# EAGLE design WallPower_5V2A (EAGLE 7.6.0)
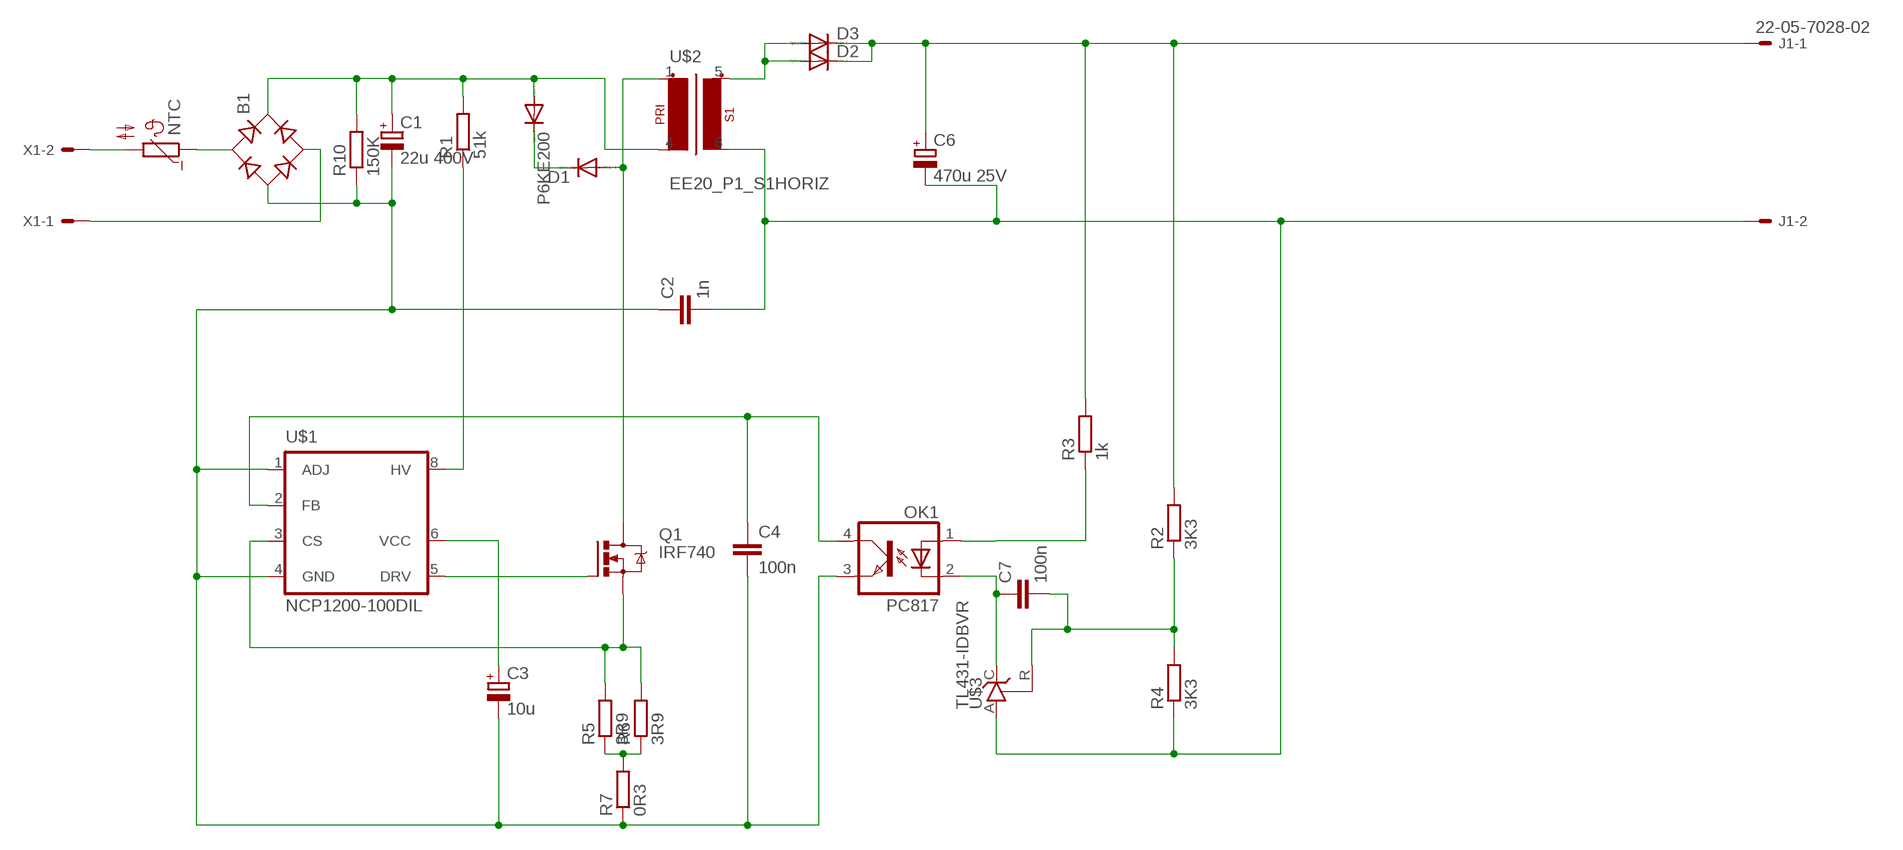
[diagram p0: schematic, sheet 1]

## Parts
B1  RB1A  [RB1A]
C1  22u 400V  CPOL-EUE5-13  [E5-13]
C2  1n  C-EU050-024X044  [C050-024X044]
C3  10u  CPOL-EUE2.5-5  [E2,5-5]
C4  100n  C-EUC0805  [C0805]
C6  470u 25V  CPOL-EUE2.5-7  [E2,5-7]
C7  100n  C-EUC0805  [C0805]
D1  DIODE-DO-214AC  [DO-214AC]
D2  DIODE-DO-214AC  [DO-214AC]
D3  DIODE-DO-214AC  [DO-214AC]
J1  22-05-7028-02  [7395-02]
NTC  B57164  [B57164]
OK1  PC817  [DIL04]
P6KE200  DIODE-DO15-12  [DO15-12]
Q1  IRF740  [TO220BV]
R1  51k  R-EU_0922/22  [0922/22]
R2  3K3  R-EU_R1206  [R1206]
R3  1k  R-EU_R1206  [R1206]
R4  3K3  R-EU_R1206  [R1206]
R5  3R9  R-EU_0411/12  [0411/12]
R6  3R9  R-EU_0411/12  [0411/12]
R7  0R3  R-EU_0411/12  [0411/12]
R10  150K  R-EU_0204/7  [0204/7]
U$1  NCP1200-100DIL  [DIP08]
U$2  EE20_P1_S1HORIZ  [EE20_P1_S1_HORIZ_REV]
U$3  TL431-IDBVR  [SOT23-5]
X1  KK-156-2  [KK-156-2]

## Nets
N$1: NTC.2 X1.2
N$2: B1.AC1 NTC.1
N$3: B1.AC2 X1.1
N$4: R5.1 R6.1 R7.2
N$5: B1.- C1.- C2.1 C3.- C4.2 OK1.3(EMIT) R7.1 R10.1 U$1.1(ADJ) U$1.4(GND)
N$6: B1.+ C1.+ P6KE200.A R1.2 R10.2 U$2.4(P1-2)
N$7: D1.C P6KE200.C
N$8: D1.A Q1.D U$2.1(P1-1)
N$9: C2.2 C6.- J1.2 R4.1 U$2.8(S1-2) U$3.A
N$10: R1.1 U$1.8(HV)
N$11: Q1.G U$1.5(DRV)
N$12: Q1.S R5.2 R6.2 U$1.3(CS)
N$13: C7.2 R2.1 R4.2 U$3.R
N$14: C3.+ U$1.6(VCC)
N$15: C4.1 OK1.4(COL) U$1.2(FB)
N$17: D2.A D3.A U$2.5(S1-1)
N$18: C6.+ D2.C D3.C J1.1 R2.2 R3.2
N$20: OK1.1(A) R3.1
N$31: C7.1 OK1.2(C) U$3.C

## Library data of the parts
B1 = rectifier:RB1A: RECTIFIER 1 A
C1 C3 C6 = rcl:CPOL-EU: POLARIZED CAPACITOR, European symbol
C2 C4 C7 = rcl:C-EU: CAPACITOR, European symbol
D1-D3 P6KE200 = diode:DIODE-: DIODE
J1 = con-molex:22-?-02: CONNECTOR wire to board 2.54 mm (.1 inch) pitch header; OC_FARNELL: 9731601; OC_NEWARK: unknown
NTC = ptc-ntc:B57164: SIEMENS NTC; MPN: B57164K474K52; OC_FARNELL: 9753451; OC_NEWARK: 29M3118
OK1 = optocoupler:PC817: SHARP OPTO COUPLER; MPN: PC817X4J000F; OC_FARNELL: 9707727; OC_NEWARK: 97K7059
Q1 = transistor-power:IRF740: N-CHANNEL MOS FET
R1-R7 R10 = rcl:R-EU_: RESISTOR, European symbol
U$1 = NCP1200:NCP1200-100
U$2 = _Transformers:EE20_P1_S1
U$3 = TL431:TL431-IDBVR
X1 = con-molex:KK-156-2: KK 156 HEADER Source: http://www.molex.com/pdm_docs/sd/026604100_sd.pdf; OC_FARNELL: unknown; OC_NEWARK: unknown

## Board
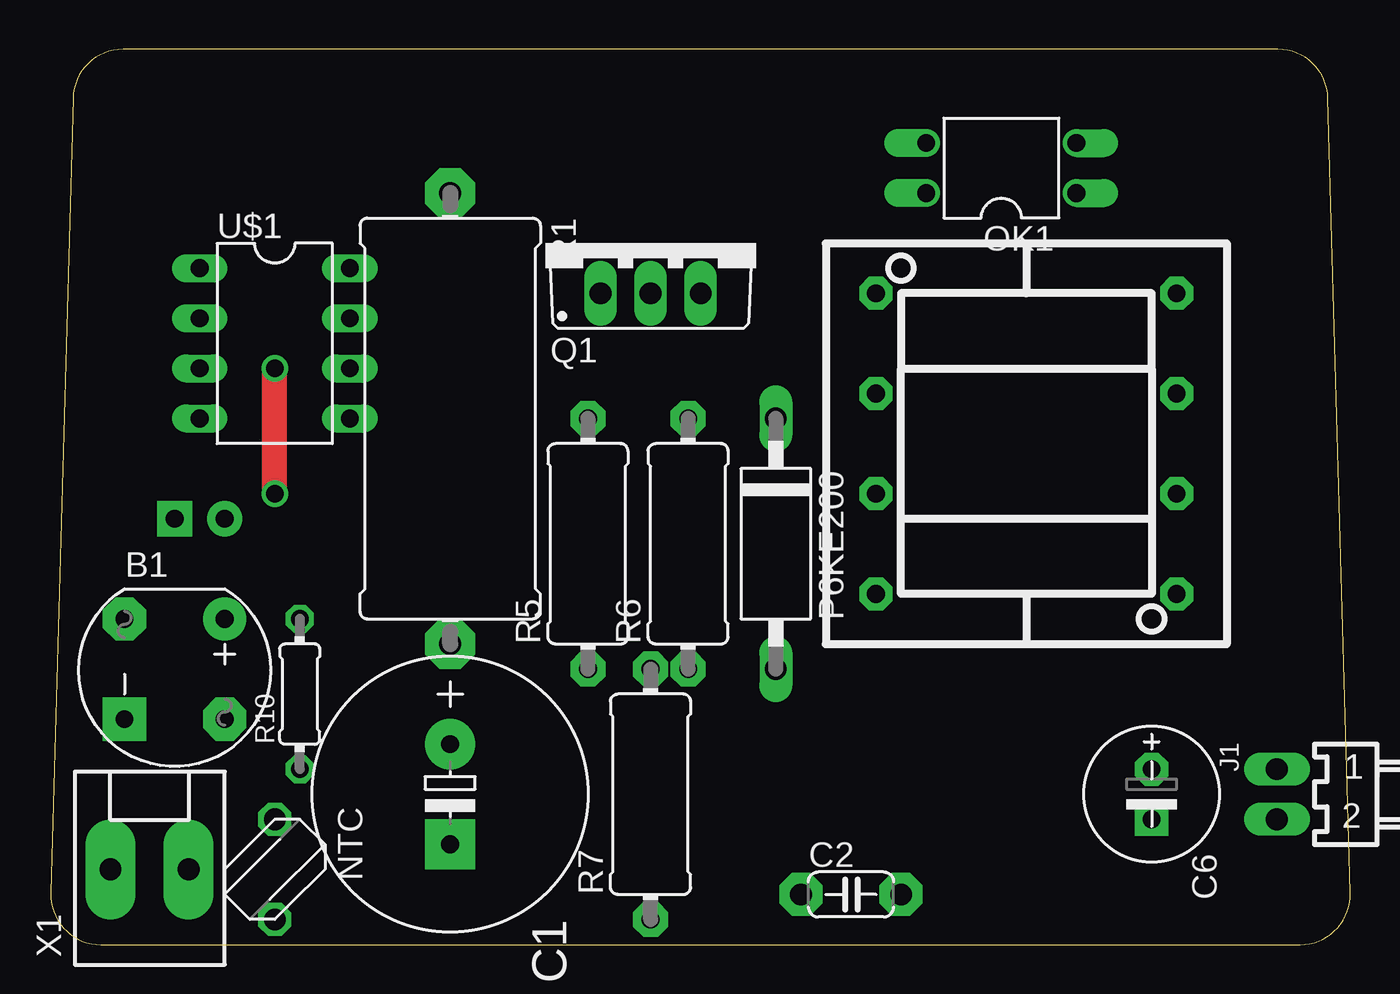
[diagram p1: board, top side]
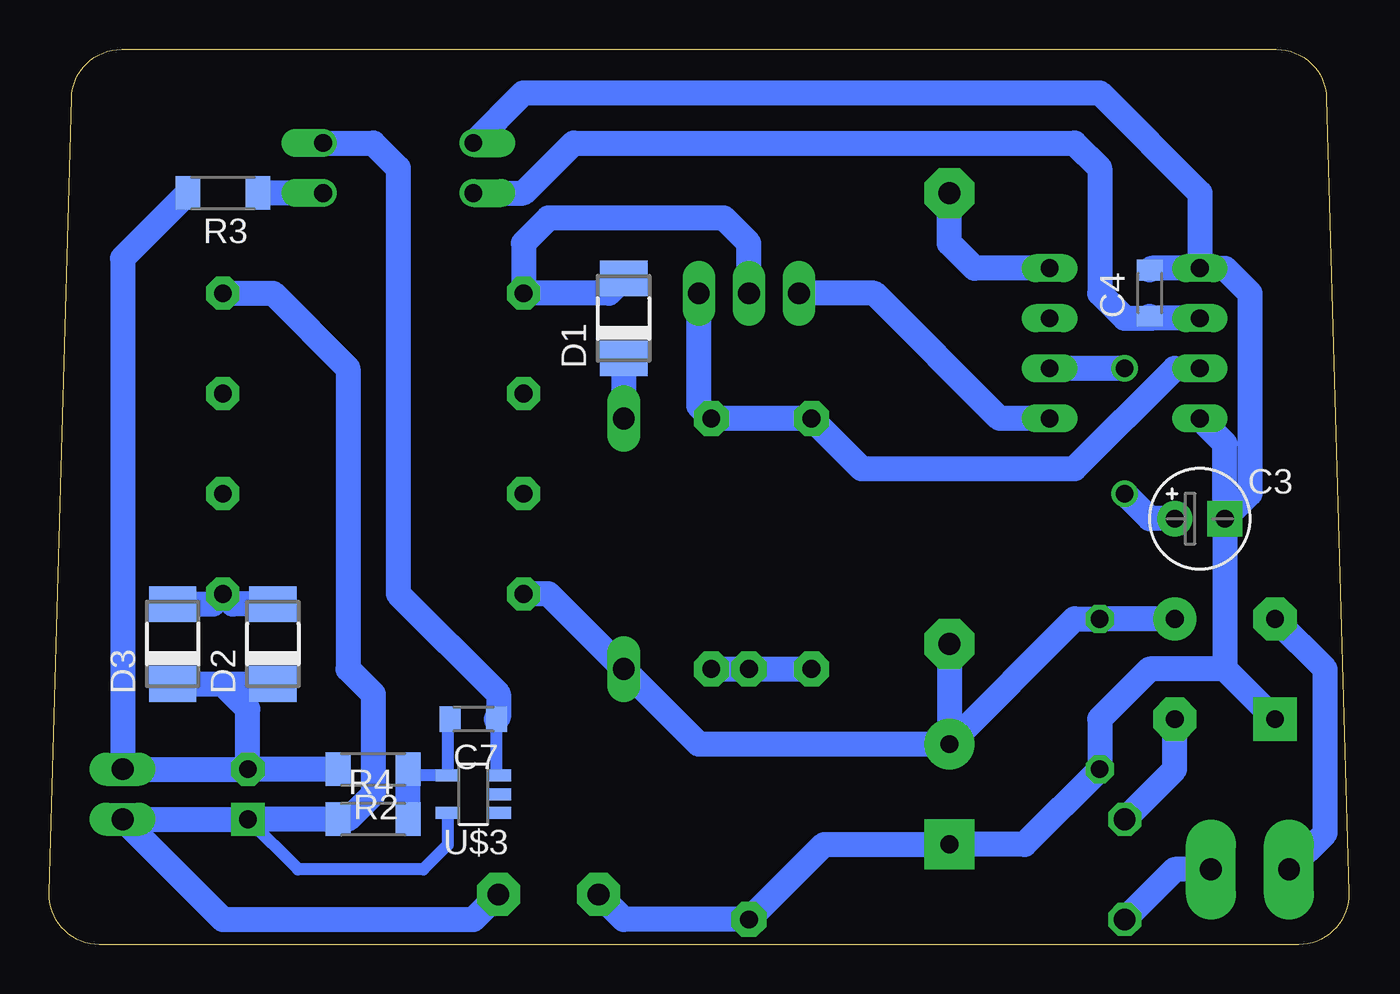
[diagram p2: board, bottom side, seen from below]

Size 65.87 x 45.39 mm. Coordinates in mm from the lower left corner, seen from the top.
Outline: 1.13,42.92 0,2.61 arc92 2.54,0 63.33,0 arc92 65.87,2.61 64.75,42.92 arc88 62.21,45.39 3.67,45.39 arc88 1.13,42.92
Copper layers (1*16): Top 0.035mm / dielectric 1.5mm / Bottom 0.035mm
Design rules "default": minimum track width 10mil, minimum drill 24mil, track to track 8mil, track to pad 8mil, pad to pad 8mil, via to via 8mil, smd to smd 8mil, copper to edge 40mil, drill to drill 8mil, minimum pad ring 10mil, minimum via ring 8mil, stop-mask expansion 4mil, vias tented up to drill 0mil, thermal gap 10mil

### Footprints (pad centres in the part's own frame; a part is rotated, then mirrored left to right if it is on the bottom)
RB1A = drill 0.9 pad 2.184: + -2.54,2.54 | drill 0.9 pad 2.184 square: - 2.54,-2.54 | drill 0.9 pad 2.184 octagon: AC1 2.54,2.54; AC2 -2.54,-2.54
E5-13 = drill 0.9 pad 2.54: + -2.54,0 | drill 0.9 pad 2.54 square: - 2.54,0
C050-024X044 = drill 1.1 pad 2.184 octagon: 1 -2.54,0; 2 2.54,0
E2,5-5 = drill 0.9 pad 1.778: + -1.27,0 | drill 0.9 pad 1.778 square: - 1.27,0
C0805 = smd 1.05 x 1.3: 1 -1.175,0; 2 1.175,0
E2,5-7 = drill 0.9 pad 1.676 octagon: + -1.27,0 | drill 0.9 pad 1.676 square: - 1.27,0
DO-214AC = smd 1.8 x 2.4: A 2.025,0; C -2.025,0
7395-02 = drill 1.1 pad 1.676 long: 1 1.27,0; 2 -1.27,0
B57164 = drill 1.1 pad 1.676 octagon: 1 -2.54,0; 2 2.54,0
DIL04 = drill 0.9 pad 1.27 offset: 1 -1.27,-3.81; 2 1.27,-3.81; 3 1.27,3.81; 4 -1.27,3.81
DO15-12 = drill 1.1 pad 1.676 long: A 6.35,0; C -6.35,0
TO220BV = drill 1.1 pad 1.422 long: D 0,-2.54; G -2.54,-2.54; S 2.54,-2.54
0922/22 = drill 1.1 pad 2.54 octagon: 1 -11.43,0; 2 11.43,0
R1206 = smd 1.25 x 1.7: 1 -1.775,0; 2 1.775,0
0411/12 = drill 0.9 pad 1.778 octagon: 1 -6.35,0; 2 6.35,0
0204/7 = drill 0.9 pad 1.422 octagon: 1 -3.81,0; 2 3.81,0
DIP08 = drill 0.9 pad 1.27 long: 1 -2.54,-3.81; 2 0,-3.81; 3 2.54,-3.81; 4 5.08,-3.81; 5 5.08,3.81; 6 2.54,3.81; 7 0,3.81; 8 -2.54,3.81
EE20_P1_S1_HORIZ_REV = drill 0.9 pad 1.676 octagon: 1 -7.62,-7.62; 2 -2.54,-7.62; 3 2.54,-7.62; 4 7.62,-7.62; 5 7.62,7.62; 6 2.54,7.62; 7 -2.54,7.62; 8 -7.62,7.62
SOT23-5 = smd 0.6 x 1.2: + 0,-2.576; A -0.95,0.036; C 0.95,-2.576; NC -0.95,-2.576; R 0.95,0.036
KK-156-2 = drill 1.1 pad 2.54 long: 1 -1.98,0; 2 1.98,0

### Placement (x,y rotation side)
B1  6.28,13.97 270 top
C1  20.25,7.62 270 top
C2  40.57,2.54 0 top
C3  7.55,21.59 0 bottom
C4  10.09,33.02 90 bottom
C6  55.81,7.62 270 top
C7  44.38,11.43 180 bottom
D1  36.76,31.75 90 bottom
D2  54.54,15.24 90 bottom
D3  59.62,15.24 90 bottom
J1  62.16,7.62 90 top
NTC  11.36,3.81 270 top
OK1  48.19,39.37 90 top
P6KE200  36.76,20.32 270 top
Q1  30.41,35.56 0 top
R1  20.25,26.67 270 top
R2  49.46,8.89 180 bottom
R3  57.08,38.1 180 bottom
R4  49.46,6.35 0 bottom
R5  27.23,20.32 90 top
R6  32.31,20.32 90 top
R7  30.41,7.62 90 top
R10  12.63,12.7 90 top
U$1  11.36,31.75 270 top
U$2  49.46,25.4 270 top
U$3  45.65,7.62 90 bottom
X1  5.01,3.81 0 top

### Tracks (layer width: path | path; a pad name or v marks a point on that pad's centre or on a via)
N$1
  Bottom 1.27: X1.2 8.82,3.81 NTC.2
N$2
  Bottom 1.27: NTC.1 8.82,8.89 B1.AC1
N$3
  Bottom 1.27: X1.1 1.2,5.64 1.2,13.97 B1.AC2
N$4
  Bottom 1.27: R5.1 R7.2 R6.1
N$5
  Bottom 1.27: B1.- 6.28,13.97 | 6.28,13.97 10.09,13.97 12.63,11.43 R10.1 16.44,5.08 C1.- 26.6,5.08 R7.1 36.76,1.27 C2.1 | C3.- 6.28,13.97 | C3.- 6.28,25.4 U$1.4 | U$1.1 6.28,34.29 5.01,33.02 5.01,22.86 C3.- | U$1.1 9.99,34.29 C4.2 | OK1.3 41.84,43.18 12.63,43.18 7.55,38.1 U$1.1
N$6
  Bottom 1.27: U$2.4 40.57,17.78 P6KE200.A 32.95,10.16 C1.+ | B1.+ R10.2 13.9,16.51 C1.+ | R1.2 C1.+
N$7
  Bottom 1.27: D1.C P6KE200.C
N$8
  Bottom 1.27: D1.A 37.51,33.02 U$2.1 41.84,35.56 40.57,36.83 31.68,36.83 30.41,35.56 Q1.D
N$9
  Bottom 0.61: U$3.A 45.68,5.04 46.92,3.81 53.27,3.81 C6.-
  Bottom 1.27: C2.2 44.38,1.27 57.08,1.27 J1.2 C6.- R4.1 50.73,6.35 49.46,7.62 49.46,12.7 50.73,13.97 50.73,29.21 54.54,33.02 U$2.8
N$10
  Bottom 1.27: U$1.8 18.98,34.29 20.25,35.56 R1.1
N$11
  Bottom 1.27: U$1.5 17.71,26.67 24.06,33.02 Q1.G
N$12
  Bottom 1.27: Q1.S 32.95,27.3 R6.2 R5.2 24.69,24.13 13.9,24.13 8.82,29.21 U$1.3
N$13
  Bottom 0.61: R2.1 47.36,8.57 U$3.R 45.68,11.3 C7.2
  Bottom 1.27: R4.2 R2.1
N$14  (via drill 0.9)
  Top 1.27: v11.36,22.86 v11.36,29.21
  Bottom 1.27: C3.+ 10.09,21.59 v11.36,22.86 | v11.36,29.21 U$1.6
N$15
  Bottom 1.27: U$1.2 9.99,31.75 C4.1 10.18,31.75 11.36,31.75 12.63,33.02 12.63,39.37 13.9,40.64 39.3,40.64 41.84,38.1 OK1.4
N$17
  Bottom 1.27: D2.A 56.56,17.27 U$2.5 57.59,17.27 D3.A
N$18
  Bottom 1.27: D3.C 57.08,13.21 | 57.08,13.21 D2.C | C6.+ 55.81,11.95 57.08,13.21 | C6.+ J1.1 62.16,34.8 R3.2 | R2.2 C6.+
N$20
  Bottom 1.27: OK1.1 R3.1
N$31
  Bottom 0.61: U$3.C 43.2,8.7 C7.1
  Bottom 1.27: OK1.2 49.46,40.64 48.19,39.37 48.19,17.78 43.11,12.7 43.11,11.53 C7.1